# Altium schematic sheet Top Sheet.SchDoc
size A; SheetNumber: 1; SheetTotal: 5
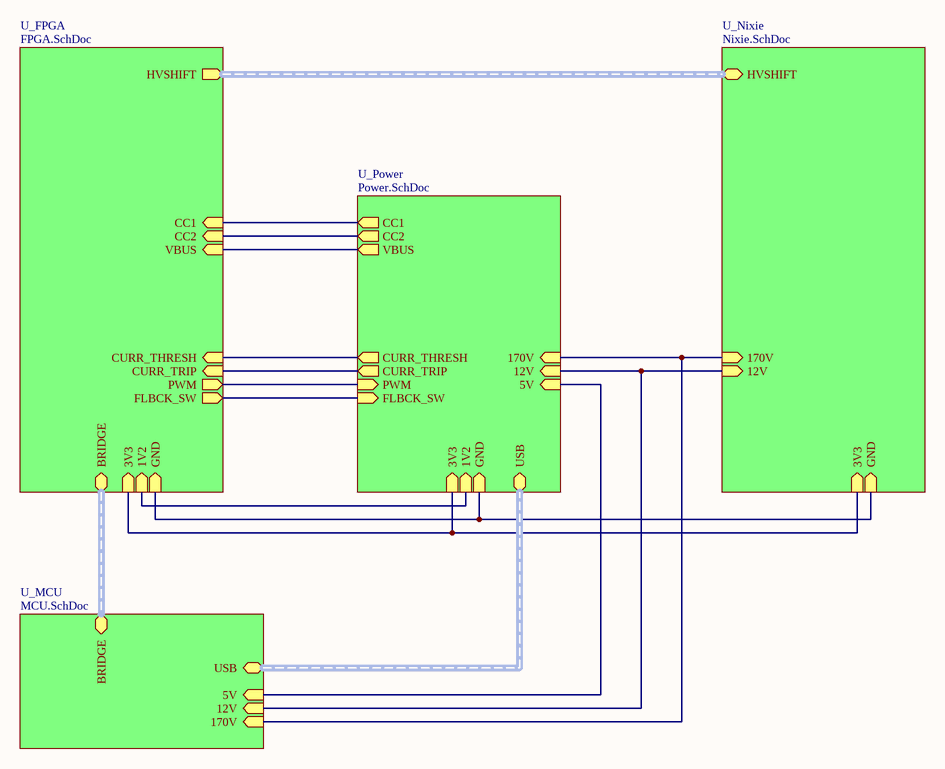
[diagram p0: Top Sheet.SchDoc]

## Sub-sheets
U_FPGA = FPGA.SchDoc: 3V3 (in), GND (in), 1V2 (in), BRIDGE (bidir), FLBCK_SW (out), HVSHIFT (out), CC2 (in), CC1 (in), VBUS (in), CURR_TRIP (in), CURR_THRESH (in), PWM (out)
U_MCU = MCU.SchDoc: BRIDGE (bidir), USB (bidir), 170V (in), 12V (in), 5V (in)
U_Nixie = Nixie.SchDoc: 170V (in), 12V (in), GND (in), 3V3 (in), HVSHIFT (bidir)
U_Power = Power.SchDoc: 3V3 (in), GND (in), 1V2 (in), 170V (in), CURR_TRIP (out), CURR_THRESH (out), PWM (in), 12V (in), USB (bidir), 5V (in), CC2 (out), CC1 (out), VBUS (out), FLBCK_SW (in)

## Nets
(unnamed): sheet U_FPGA/3V3, sheet U_Power/3V3, sheet U_Nixie/3V3
(unnamed): sheet U_FPGA/GND, sheet U_Power/GND, sheet U_Nixie/GND
(unnamed): sheet U_FPGA/1V2, sheet U_Power/1V2
(unnamed): sheet U_FPGA/FLBCK_SW, sheet U_Power/FLBCK_SW
(unnamed): sheet U_FPGA/CC2, sheet U_Power/CC2
(unnamed): sheet U_FPGA/CC1, sheet U_Power/CC1
(unnamed): sheet U_FPGA/VBUS, sheet U_Power/VBUS
(unnamed): sheet U_FPGA/CURR_TRIP, sheet U_Power/CURR_TRIP
(unnamed): sheet U_FPGA/CURR_THRESH, sheet U_Power/CURR_THRESH
(unnamed): sheet U_FPGA/PWM, sheet U_Power/PWM
(unnamed): sheet U_Power/170V, sheet U_Nixie/170V, sheet U_MCU/170V
(unnamed): sheet U_Power/12V, sheet U_Nixie/12V, sheet U_MCU/12V
(unnamed): sheet U_Power/5V, sheet U_MCU/5V

## Buses and harness runs
harness sheet U_FPGA/BRIDGE = sheet U_MCU/BRIDGE
harness sheet U_FPGA/HVSHIFT = sheet U_Nixie/HVSHIFT
harness sheet U_MCU/USB = sheet U_Power/USB